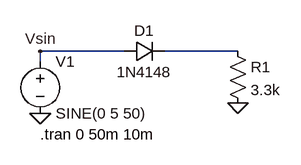
[diagram p0: schematic HalfRectifer.asc]
HalfRectifer.asc, the LTspice schematic file:
Version 4
SHEET 1 880 680
WIRE 320 32 192 32
WIRE 496 32 384 32
WIRE 192 48 192 32
FLAG 192 32 Vsin
FLAG 496 112 0
FLAG 192 128 0
SYMBOL voltage 192 32 R0
WINDOW 123 0 0 Left 0
WINDOW 39 0 0 Left 0
SYMATTR InstName V1
SYMATTR Value SINE(0 5 50)
SYMBOL res 480 16 R0
SYMATTR InstName R1
SYMATTR Value 3.3k
SYMBOL diode 320 48 R270
WINDOW 0 32 32 VTop 2
WINDOW 3 0 32 VBottom 2
SYMATTR InstName D1
SYMATTR Value 1N4148
TEXT 192 160 Left 2 !.tran 0 50m 10m

The netlist it stands for:
* HalfRectifer.asc
V1 Vsin 0 SINE(0 5 50)
R1 N001 0 3.3k
D1 Vsin N001 1N4148
.model D D
.lib standard.dio
.tran 0 50m 10m
.backanno
.end